# EAGLE design rat (EAGLE 9.6.2)
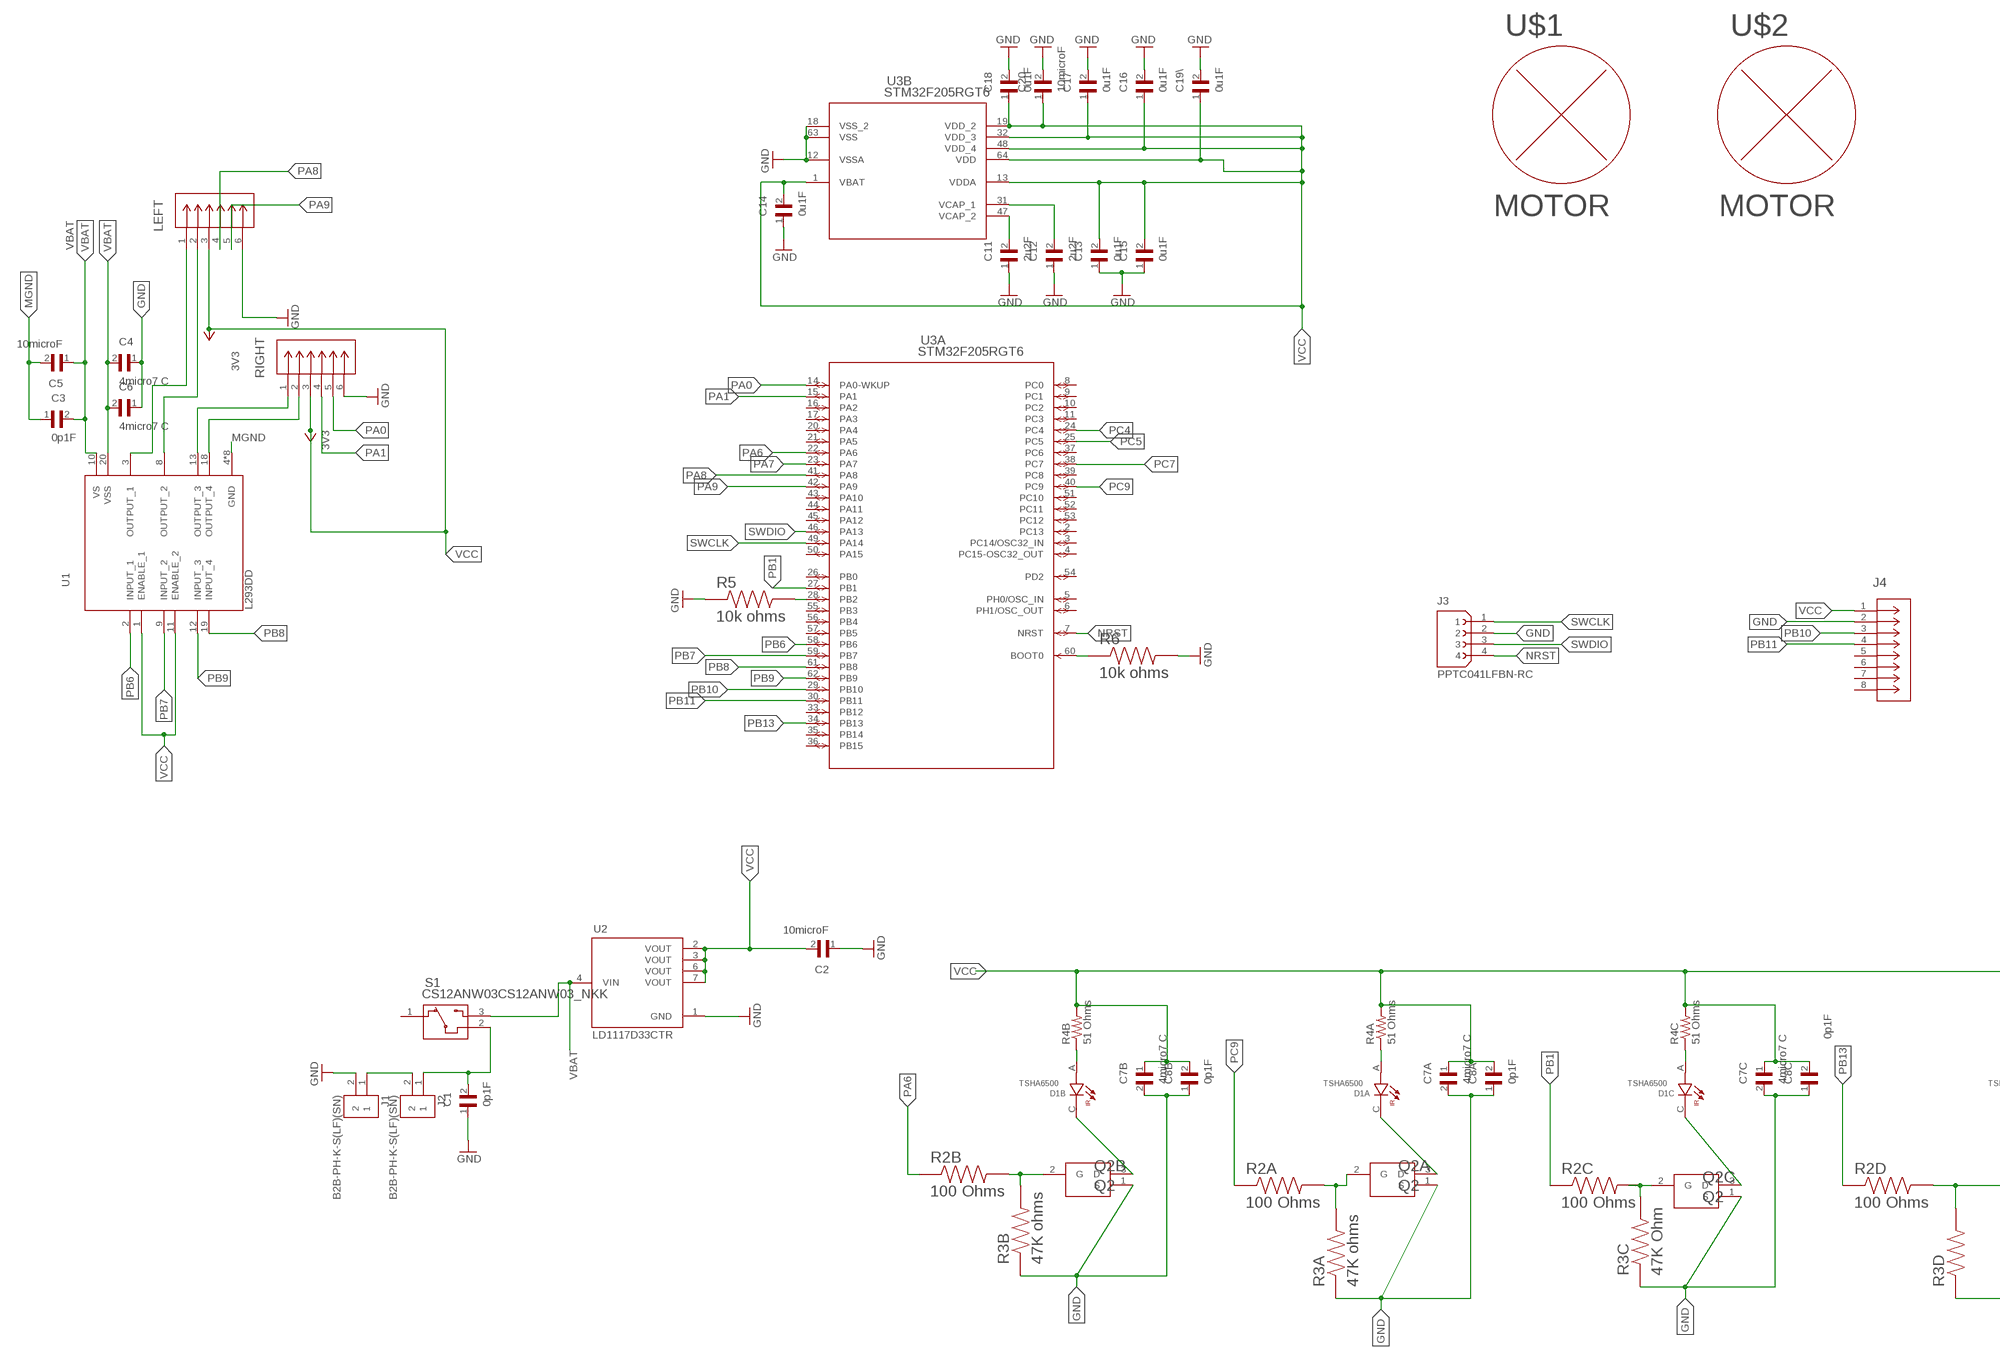
[diagram p0: schematic, sheet 1, part 1 of 2]
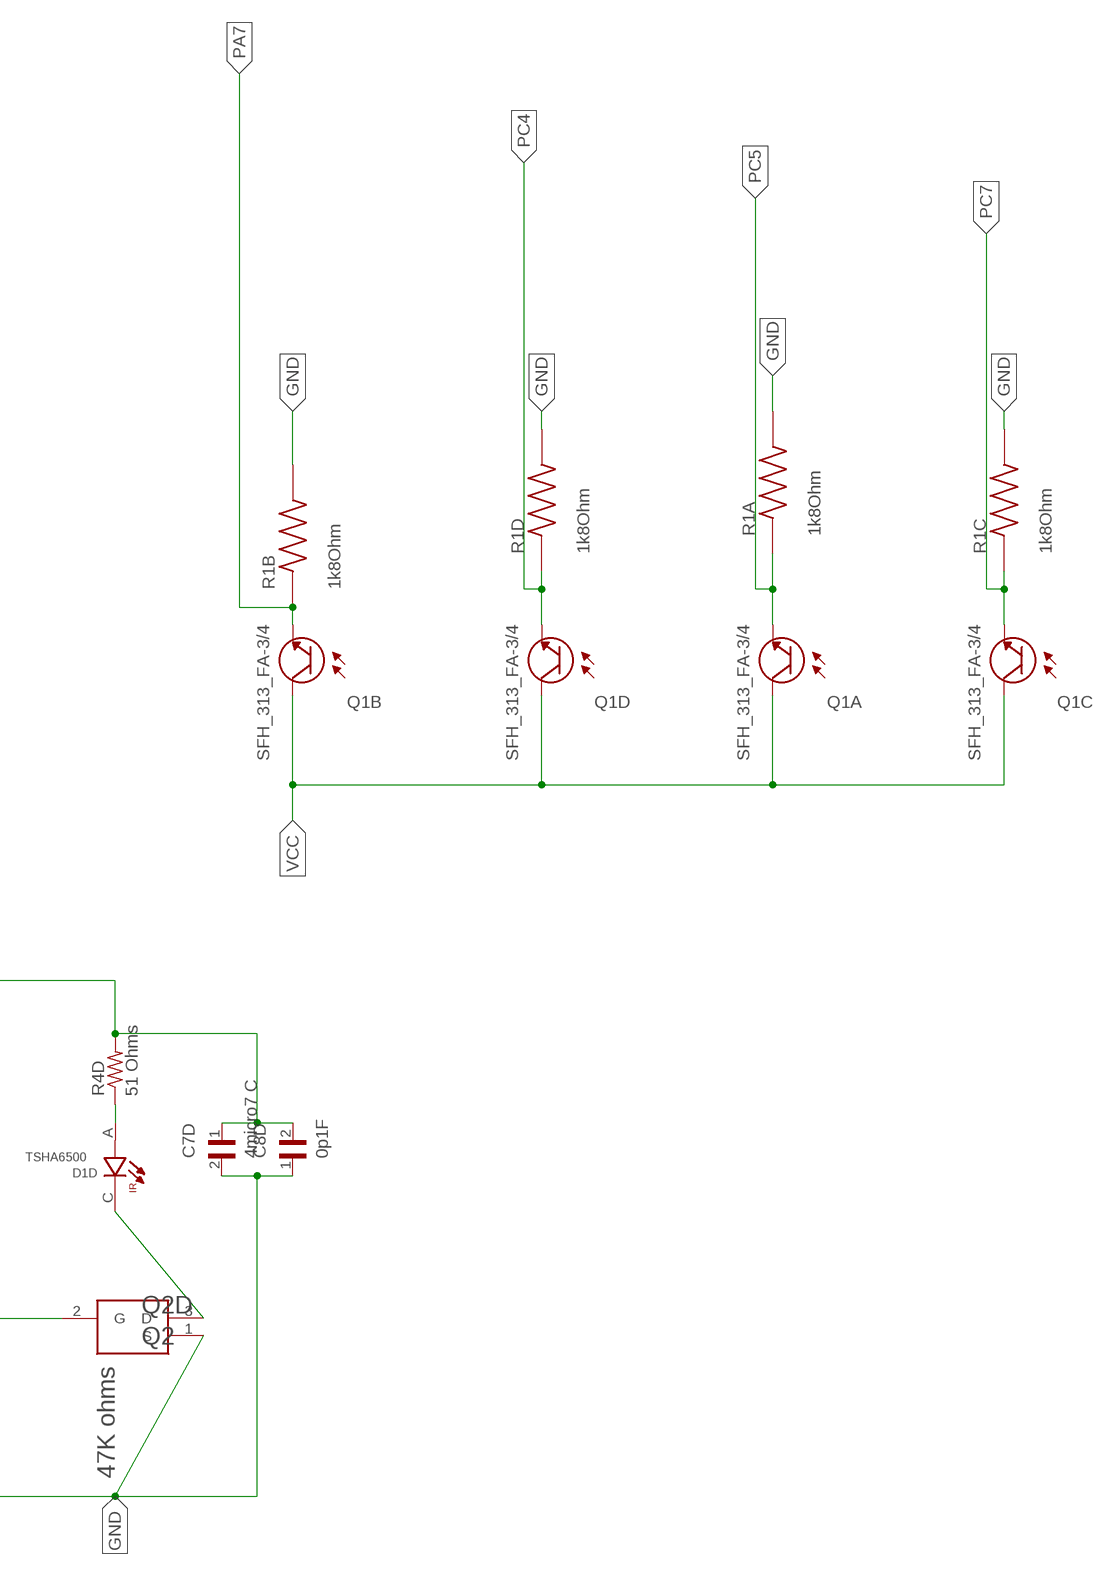
[diagram p1: schematic, sheet 1, part 2 of 2]

## Parts
C1  0p1F  12065C104JAT4A  [CAPC3216X94N]
C2  10microF  C2012X7S1C106M125AC  [CAPC2012X145N]
C3  0p1F  12065C104JAT4A  [CAPC3216X94N]
C4  4micro7 C  CL21A475KAQNNNE  [CAPC2012X140N]
C5  10microF  C2012X7S1C106M125AC  [CAPC2012X145N]
C6  4micro7 C  CL21A475KAQNNNE  [CAPC2012X140N]
C7A  4micro7 C  CL21A475KAQNNNE  [CAPC2012X140N]
C7B  4micro7 C  CL21A475KAQNNNE  [CAPC2012X140N]
C7C  4micro7 C  CL21A475KAQNNNE  [CAPC2012X140N]
C7D  4micro7 C  CL21A475KAQNNNE  [CAPC2012X140N]
C8A  0p1F  12065C104JAT4A  [CAPC3216X94N]
C8B  0p1F  12065C104JAT4A  [CAPC3216X94N]
C8C  0p1F  12065C104JAT4A  [CAPC3216X94N]
C8D  0p1F  12065C104JAT4A  [CAPC3216X94N]
C11  2u2F  CL31A225KB9LNNC  [CAPC3216X140N]
C12  2u2F  CL31A225KB9LNNC  [CAPC3216X140N]
C13  0u1F  12065C104JAT4A  [CAPC3216X94N]
C14  0u1F  12065C104JAT4A  [CAPC3216X94N]
C15  0u1F  12065C104JAT4A  [CAPC3216X94N]
C16  0u1F  12065C104JAT4A  [CAPC3216X94N]
C17  0u1F  12065C104JAT4A  [CAPC3216X94N]
C18  0u1F  12065C104JAT4A  [CAPC3216X94N]
C19\  0u1F  12065C104JAT4A  [CAPC3216X94N]
C20  10microF  C2012X7S1C106M125AC  [CAPC2012X145N]
D1A  TSHA6500  [LEDRD254W55D595H900]
D1B  TSHA6500  [LEDRD254W55D595H900]
D1C  TSHA6500  [LEDRD254W55D595H900]
D1D  TSHA6500  [LEDRD254W55D595H900]
J1  B2B-PH-K-S(LF)(SN)  [JST_B2B-PH-K-S(LF)(SN)]
J2  B2B-PH-K-S(LF)(SN)  [JST_B2B-PH-K-S(LF)(SN)]
J3  PPTC041LFBN-RC  [SULLINS_PPTC041LFBN-RC]
J4  PPTC081LFBN-RCCONN_PPTC081LFBN-RC_SUL  [CONN_PPTC081LFBN-RC_SUL]
LEFT  PPTC061LFBN-RCCONN6_061LFBN-RC_SUL  [CONN6_061LFBN-RC_SUL]
Q1A  SFH_313_FA-3/4  [XDCR_SFH_313_FA-3/4]
Q1B  SFH_313_FA-3/4  [XDCR_SFH_313_FA-3/4]
Q1C  SFH_313_FA-3/4  [XDCR_SFH_313_FA-3/4]
Q1D  SFH_313_FA-3/4  [XDCR_SFH_313_FA-3/4]
Q2A  Q2  2N7000_D26Z  [PF5102]
Q2B  Q2  2N7000_D26Z  [PF5102]
Q2C  Q2  2N7000_D26Z  [PF5102]
Q2D  Q2  2N7000_D26Z  [PF5102]
R1A  1k8Ohm  ERJH3EF1801V  [RES_ERJH3EF1801V]
R1B  1k8Ohm  ERJH3EF1801V  [RES_ERJH3EF1801V]
R1C  1k8Ohm  ERJH3EF1801V  [RES_ERJH3EF1801V]
R1D  1k8Ohm  ERJH3EF1801V  [RES_ERJH3EF1801V]
R2A  100 Ohms  RG2012P-101-B-T5  [RESC2012X50N]
R2B  100 Ohms  RG2012P-101-B-T5  [RESC2012X50N]
R2C  100 Ohms  RG2012P-101-B-T5  [RESC2012X50N]
R2D  100 Ohms  RG2012P-101-B-T5  [RESC2012X50N]
R3A  47K ohms  CRGCQ0402J47K  [RESC1005X40N]
R3B  47K ohms  CRGCQ0402J47K  [RESC1005X40N]
R3C  47K Ohm  CRGCQ0402J47K  [RESC1005X40N]
R3D  47K ohms  CRGCQ0402J47K  [RESC1005X40N]
R4A  51 Ohms  1623246-1  [RESC2012X65N]
R4B  51 Ohms  1623246-1  [RESC2012X65N]
R4C  51 Ohms  1623246-1  [RESC2012X65N]
R4D  51 Ohms  1623246-1  [RESC2012X65N]
R5  10k ohms  RN73C2A10KBTD  [RESC2012X65N]
R6  10k ohms  RN73C2A10KBTD  [RESC2012X65N]
RIGHT  PPTC061LFBN-RCCONN6_061LFBN-RC_SUL  [CONN6_061LFBN-RC_SUL]
S1  CS12ANW03CS12ANW03_NKK  [CS12ANW03_NKK]
U1  L293DD  [SOIC127P1032X265-20N]
U2  LD1117D33CTR  [SOIC127P600X175-8N]
U3  STM32F205RGT6  [LQFP64-10X10MM]
U$1  MOTOR  [MOTOR]
U$2  MOTOR  [MOTOR]

## Nets
GND: C1.1 C2.1 C4.1 C6.1 C7A.2 C7B.2 C7C.2 C7D.2 C8A.1 C8B.1 C8C.1 C8D.1 C11.1 C12.1 C13.1 C14.1 C15.1 C16.2 C17.2 C18.2 C19\.2 C20.2 J1.2 J3.2 J4.2 LEFT.6 Q2A.1(S) Q2B.1(S) Q2C.1(S) Q2D.1(S) R1A.2 R1B.2 R1C.2 R1D.2 R3A.1 R3B.1 R3C.1 R3D.1 R5.1 R6.2 RIGHT.6 U2.1(GND) U3.12(B:VSSA) U3.18(B:VSS_2) U3.63(B:VSS)
MGND: C3.1 C5.2 U1.4(GND) U1.5(GND) U1.6(GND) U1.7(GND) U1.14(GND) U1.15(GND) U1.16(GND) U1.17(GND)
N$1: J1.1 J2.2
N$2: C1.2 J2.1 S1.2
N$3: LEFT.1 U1.3(OUTPUT_1)
N$4: LEFT.2 U1.8(OUTPUT_2)
N$5: RIGHT.1 U1.13(OUTPUT_3)
N$6: RIGHT.2 U1.18(OUTPUT_4)
N$7: D1A.C Q2A.3(D)
N$8: Q2A.2(G) R2A.2 R3A.2
N$9: D1C.C Q2C.3(D)
N$10: Q2C.2(G) R2C.2 R3C.2
N$11: D1A.A R4A.1
N$12: D1C.A R4C.1
N$13: D1B.C Q2B.3(D)
N$14: Q2B.2(G) R2B.2 R3B.2
N$15: D1B.A R4B.1
N$16: D1D.C Q2D.3(D)
N$17: Q2D.2(G) R2D.2 R3D.2
N$18: D1D.A R4D.1
N$26: C11.2 U3.47(B:VCAP_2)
N$27: R6.1 U3.60(A:BOOT0)
N$28: R5.2 U3.28(A:PB2)
N$29: C12.2 U3.31(B:VCAP_1)
NRST: J3.4 U3.7(A:NRST)
PA0: RIGHT.5 U3.14(A:PA0-WKUP)
PA1: RIGHT.4 U3.15(A:PA1)
PA6: R2B.1 U3.22(A:PA6)
PA7: Q1B.1(E) R1B.1 U3.23(A:PA7)
PA8: LEFT.4 U3.41(A:PA8)
PA9: LEFT.5 U3.42(A:PA9)
PB1: R2C.1 U3.27(A:PB1)
PB6: U1.2(INPUT_1) U3.58(A:PB6)
PB7: U1.9(INPUT_2) U3.59(A:PB7)
PB8: U1.19(INPUT_4) U3.61(A:PB8)
PB9: U1.12(INPUT_3) U3.62(A:PB9)
PB10: J4.3 U3.29(A:PB10)
PB11: J4.4 U3.30(A:PB11)
PB13: R2D.1 U3.34(A:PB13)
PC4: Q1D.1(E) R1D.1 U3.24(A:PC4)
PC5: Q1A.1(E) R1A.1 U3.25(A:PC5)
PC7: Q1C.1(E) R1C.1 U3.38(A:PC7)
PC9: R2A.1 U3.40(A:PC9)
SWCLK: J3.1 U3.49(A:PA14)
SWDIO: J3.3 U3.46(A:PA13)
VBAT: C3.2 C4.2 C5.1 C6.2 S1.3 U1.10(VS) U1.20(VSS) U2.4(VIN)
VCC: C2.2 C7A.1 C7B.1 C7C.1 C7D.1 C8A.2 C8B.2 C8C.2 C8D.2 C13.2 C14.2 C15.2 C16.1 C17.1 C18.1 C19\.1 C20.1 J4.1 LEFT.3 Q1A.2(C) Q1B.2(C) Q1C.2(C) Q1D.2(C) R4A.2 R4B.2 R4C.2 R4D.2 RIGHT.3 U1.1(ENABLE_1) U1.11(ENABLE_2) U2.2(VOUT) U2.3(VOUT) U2.6(VOUT) U2.7(VOUT) U3.1(B:VBAT) U3.13(B:VDDA) U3.19(B:VDD_2) U3.32(B:VDD_3) U3.48(B:VDD_4) U3.64(B:VDD) ; supply symbol labelled 3V3
Unconnected: J4.5 J4.6 J4.7 J4.8 S1.1 U3.2(A:PC13) U3.3(A:PC14/OSC32_IN) U3.4(A:PC15-OSC32_OUT) U3.5(A:PH0/OSC_IN) U3.6(A:PH1/OSC_OUT) U3.8(A:PC0) U3.9(A:PC1) U3.10(A:PC2) U3.11(A:PC3) U3.16(A:PA2) U3.17(A:PA3) U3.20(A:PA4) U3.21(A:PA5) U3.26(A:PB0) U3.33(A:PB12) U3.35(A:PB14) U3.36(A:PB15) U3.37(A:PC6) U3.39(A:PC8) U3.43(A:PA10) U3.44(A:PA11) U3.45(A:PA12) U3.50(A:PA15) U3.51(A:PC10) U3.52(A:PC11) U3.53(A:PC12) U3.54(A:PD2) U3.55(A:PB3) U3.56(A:PB4) U3.57(A:PB5)

## Library data of the parts
C1 C3 C8A C8B C8C C8D C13-C18 C19\ = 12065C104JAT4A:12065C104JAT4A: CAP CER 0.1UF 50V X7R 1206; DESCRIPTION: 0.1 µF ±5% 50V Ceramic Capacitor X7R 1206 (3216 Metric); DIGI-KEY_PART_NUMBER: 478-12514-1-ND; MF: AVX; MP: 12065C104JAT4A; PACKAGE: 3216 AVX; PURCHASE-URL: https://pricing.snapeda.com/search/part/12065C104JAT4A/?ref=eda
C2 C5 C20 = C2012X7S1C106M125AC:C2012X7S1C106M125AC; DESCRIPTION: 10µF ±20% 16V Ceramic Capacitor X7S 0805 (2012 Metric); DIGI-KEY_PART_NUMBER: 445-175229-1-ND; MF: TDK; MP: C2012X7S1C106M125AC; PACKAGE: 2012 TDK; PURCHASE-URL: https://pricing.snapeda.com/search/part/C2012X7S1C106M125AC/?ref=eda
C4 C6 C7A C7B C7C C7D = CL21A475KAQNNNE:CL21A475KAQNNNE: CL21 Series 4.7 uF 25 V ±10 % Tolerance X5R SMT Multilayer Ceramic Capacitor; DESCRIPTION: 4.7 µF ±10% 25V Ceramic Capacitor X5R 0805 (2012 Metric); DIGI-KEY_PART_NUMBER: 1276-1244-1-ND; MF: Samsung Electro-Mechanics; MP: CL21A475KAQNNNE; PACKAGE: 0805 Samsung; PURCHASE-URL: https://pricing.snapeda.com/search/part/CL21A475KAQNNNE/?ref=eda
C11 C12 = CL31A225KB9LNNC:CL31A225KB9LNNC: Cap Ceramic 2.2uF 50V X5R 10% SMD 1206 85C T/R; DESCRIPTION: 2.2 µF ±10% 50V Ceramic Capacitor X5R 1206 (3216 Metric); DIGI-KEY_PART_NUMBER: 1276-2723-1-ND; MF: Samsung Electro-Mechanics; MP: CL31A225KB9LNNC; PACKAGE: 1206 Samsung; PURCHASE-URL: https://pricing.snapeda.com/search/part/CL31A225KB9LNNC/?ref=eda
D1A D1B D1C D1D = TSHA6500:TSHA6500: IR-EMITTER HIGH SPEED 870NM 5MM RoHSconf Check prices <https://pricing.snapeda.com/parts/TSHA6500/Vishay/view-part?ref=eda>; AVAILABILITY: Warning; DESCRIPTION: EMITTER IR 875NM 100MA RADIAL; MF: Vishay; MP: TSHA6500; PACKAGE: Radial Vishay; PRICE: None; PURCHASE-URL: https://pricing.snapeda.com/search/part/TSHA6500/?ref=eda
J1 J2 = B2B-PH-K-S_LF__SN_:B2B-PH-K-S(LF)(SN): PH Series 2 Position 2 mm Pitch Through Hole Top Entry Shrouded Header; DESCRIPTION: Connector Header Through Hole 2 position 0.079 (2.00mm); DIGI-KEY_PART_NUMBER: 455-1704-ND; MF: JST Sales; MP: B2B-PH-K-S(LF)(SN); PACKAGE: None
J3 = PPTC041LFBN-RC:PPTC041LFBN-RC: 4 Position Header Connector Through Hole; DESCRIPTION: 4 Position Header Connector 0.100 (2.54mm) Through Hole Tin; DIGI-KEY_PART_NUMBER: S7002-ND; MF: Sullins Connector; MP: PPTC041LFBN-RC; PACKAGE: None; PURCHASE-URL: https://pricing.snapeda.com/search/part/PPTC041LFBN-RC/?ref=eda
J4 = 2022-01-23_01-52-53_Library:PPTC081LFBN-RC; COPYRIGHT: Copyright (C) 2022 Ultra Librarian. All rights reserved.; DIGI-KEY_PART_NUMBER_1: S7006-ND; DIGI-KEY_PART_NUMBER_2: S7006-NDL; MANUFACTURER_PART_NUMBER: PPTC081LFBN-RC; MFR_NAME: Sullins
LEFT RIGHT = 2022-01-09_23-02-47_Library:PPTC061LFBN-RC; COPYRIGHT: Copyright (C) 2022 Ultra Librarian. All rights reserved.; DIGI-KEY_PART_NUMBER_1: S7004-ND; MANUFACTURER_PART_NUMBER: PPTC061LFBN-RC; MFR_NAME: Sullins
Q1A Q1B Q1C Q1D = SFH_313_FA-3_4:SFH_313_FA-3/4: Phototransistor IR Chip Silicon 870nm 2-Pin T-1 3/4; AVAILABILITY: Unavailable; DESCRIPTION: Phototransistors 870nm Top View Radial - 2 Leads; MF: OSRAM Opto; MP: SFH 313 FA-3/4; PACKAGE: Radial-2 Osram Opto; PRICE: None
Q2A Q2B Q2C Q2D = SamacSys_Parts:2N7000_D26Z: MOSFET N-Ch 60V 200mA Enhancement TO-92 Fairchild 2N7000_D26Z N-channel MOSFET Transistor, 200 mA, 60 V, 3-Pin TO-92 Source: Datasheet; ARROW_PART_NUMBER: 2N7000_D26Z; ARROW_PRICE-STOCK: https://www.arrow.com/en/products/2n7000-d26z/on-semiconductor?region=nac; DESCRIPTION: MOSFET N-Ch 60V 200mA Enhancement TO-92 Fairchild 2N7000_D26Z N-channel MOSFET Transistor, 200 mA, 60 V, 3-Pin TO-92; HEIGHT: 5.33mm; MANUFACTURER_NAME: ON Semiconductor; MANUFACTURER_PART_NUMBER: 2N7000_D26Z; MOUSER_PART_NUMBER: 512-2N7000D26Z; MOUSER_PRICE-STOCK: http://www.mouser.com/Search/ProductDetail.aspx?qs=VVLQfEDCVmOkjPtXWYsceQ%3d%3d
R1A R1B R1C R1D = ERJH3EF1801V:ERJH3EF1801V; DESCRIPTION: High Temperature Thick Film Chip Resistor (Automotive Grade), ERJH3E Series, 0.018K Ohm +/-1% , 0.125W , 0603 size , chip resistor (1.6 x 0.8 x 0.45mm); DIGI-KEY_PART_NUMBER: 10-ERJ-H3EF1801VCT-ND; MF: Panasonic; MP: ERJH3EF1801V; PACKAGE: 1608-2 Panasonic; PURCHASE-URL: https://pricing.snapeda.com/search/part/ERJH3EF1801V/?ref=eda
R2A R2B R2C R2D = RG2012P-101-B-T5:RG2012P-101-B-T5: Res Thin Film 0805 100 Ohm 0.1% 0.125W(1/8W) ?25ppm/C Molded SMD Automotive T/R; DESCRIPTION: 100 Ohms ±0.1% 0.125W, 1/8W Chip Resistor 0805 (2012 Metric) Anti-Sulfur, Automotive AEC-Q200 Thin Film; DIGI-KEY_PART_NUMBER: RG20P100BCT-ND; MF: Susumu; MP: RG2012P-101-B-T5; PACKAGE: 2012 TE Connectivity; PURCHASE-URL: https://pricing.snapeda.com/search/part/RG2012P-101-B-T5/?ref=eda
R3A R3B R3C R3D = CRGCQ0402J47K:CRGCQ0402J47K: Fixed Resistor CRGCQ 0402 47K 5% Check availability <https://pricing.snapeda.com/parts/CRGCQ0402J47K/TE%20Connectivity/view-part?ref=eda>; AVAILABILITY: In Stock; COMMENT: 2-2176338-9; DESCRIPTION: Fixed Resistor CRGCQ 0402 47K 5%; MF: TE Connectivity; MP: CRGCQ0402J47K; PACKAGE: 1005 Yageo; PRICE: None; PURCHASE-URL: https://pricing.snapeda.com/search/part/CRGCQ0402J47K/?ref=eda
R4A R4B R4C R4D = 1623246-1:1623246-1: CRG0805 1% 51R; COMMENT: 1623246-1; DESCRIPTION: 51 Ohms ±1% 0.125W, 1/8W Chip Resistor 0805 (2012 Metric) - Thick Film; DIGI-KEY_PART_NUMBER: A126374CT-ND; EU_ROHS_COMPLIANCE: Compliant with Exemptions; MF: TE Connectivity; MP: 1623246-1; PACKAGE: 0805; POWER_RATING: .125 W; RESISTANCE: 51; TOLERANCE: 1%; VOLTAGE_RATING: 150 V
R5 R6 = RN73C2A10KBTD:RN73C2A10KBTD: RN 0805 10K 0.1% 10PPM 5KRL Check availability <https://pricing.snapeda.com/parts/RN73C2A10KBTD/TE%20Connectivity/view-part?ref=eda>; AVAILABILITY: In Stock; COMMENT: 1676153-3; DESCRIPTION: RN 0805 10K 0.1% 10PPM 5KRL; EU_ROHS_COMPLIANCE: Compliant; MF: TE Connectivity; MP: RN73C2A10KBTD; PACKAGE: 0805; POWER_RATING: .1 W; PRICE: None; PURCHASE-URL: https://pricing.snapeda.com/search/part/RN73C2A10KBTD/?ref=eda; RESISTANCE: 10K; TOLERANCE: .1%; VOLTAGE_RATING: 100 V
S1 = 2022-01-23_02-20-39_Library:CS12ANW03; COPYRIGHT: Copyright (C) 2022 Ultra Librarian. All rights reserved.; DIGI-KEY_PART_NUMBER_1: 360-2131-ND; MANUFACTURER_PART_NUMBER: CS12ANW03; MFR_NAME: NKK Switches
U1 = L293DD:L293DD: L293DD Series Push - Pull Quad Channel Driver with Diodes - SOIC-20; DESCRIPTION: Bipolar Motor Driver Parallel 20-SOIC; DIGI-KEY_PART_NUMBER: 497-2937-2-ND; MF: STMicroelectronics; MP: L293DD; PACKAGE: SOIC-20 STMicroelectronics; PURCHASE-URL: https://pricing.snapeda.com/search/part/L293DD/?ref=eda
U2 = LD1117D33CTR:LD1117D33CTR: LD1117 Series 1300 mA Low Drop Fixed Positive Voltage Regulator - SOIC-8; DESCRIPTION: Linear Voltage Regulator IC Positive Fixed 1 Output 800mA 8-SOIC; DIGI-KEY_PART_NUMBER: 497-1230-1-ND; MF: STMicroelectronics; MP: LD1117D33CTR; PACKAGE: SOIC-8 STMicroelectronics; PURCHASE-URL: https://pricing.snapeda.com/search/part/LD1117D33CTR/?ref=eda
U3 = stm32f205rgt6:STM32F205RGT6; COPYRIGHT: Copyright (C) 2021 Ultra Librarian. All rights reserved.; MANUFACTURER_PART_NUMBER: STM32F205RGT6; MFR_NAME: STMicroelectronics
U$1 U$2 = micromouseMotors:MOTOR

## Board
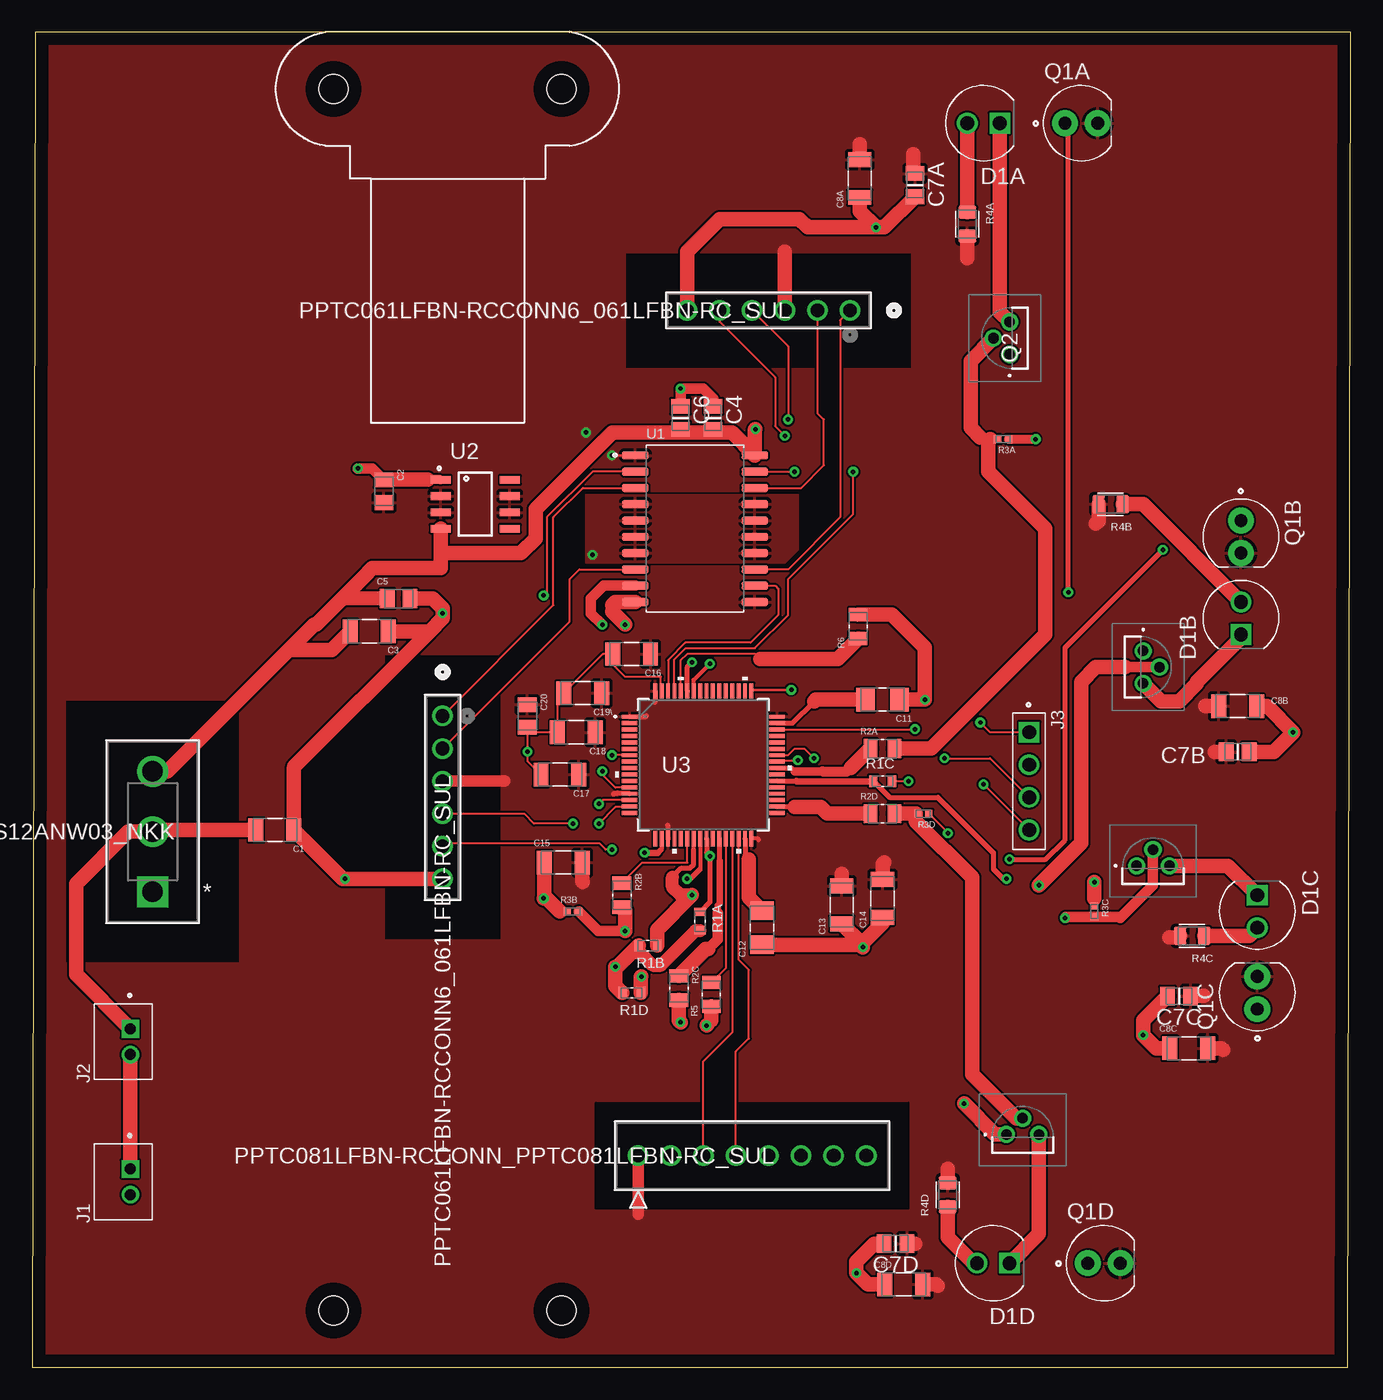
[diagram p2: board, top side]
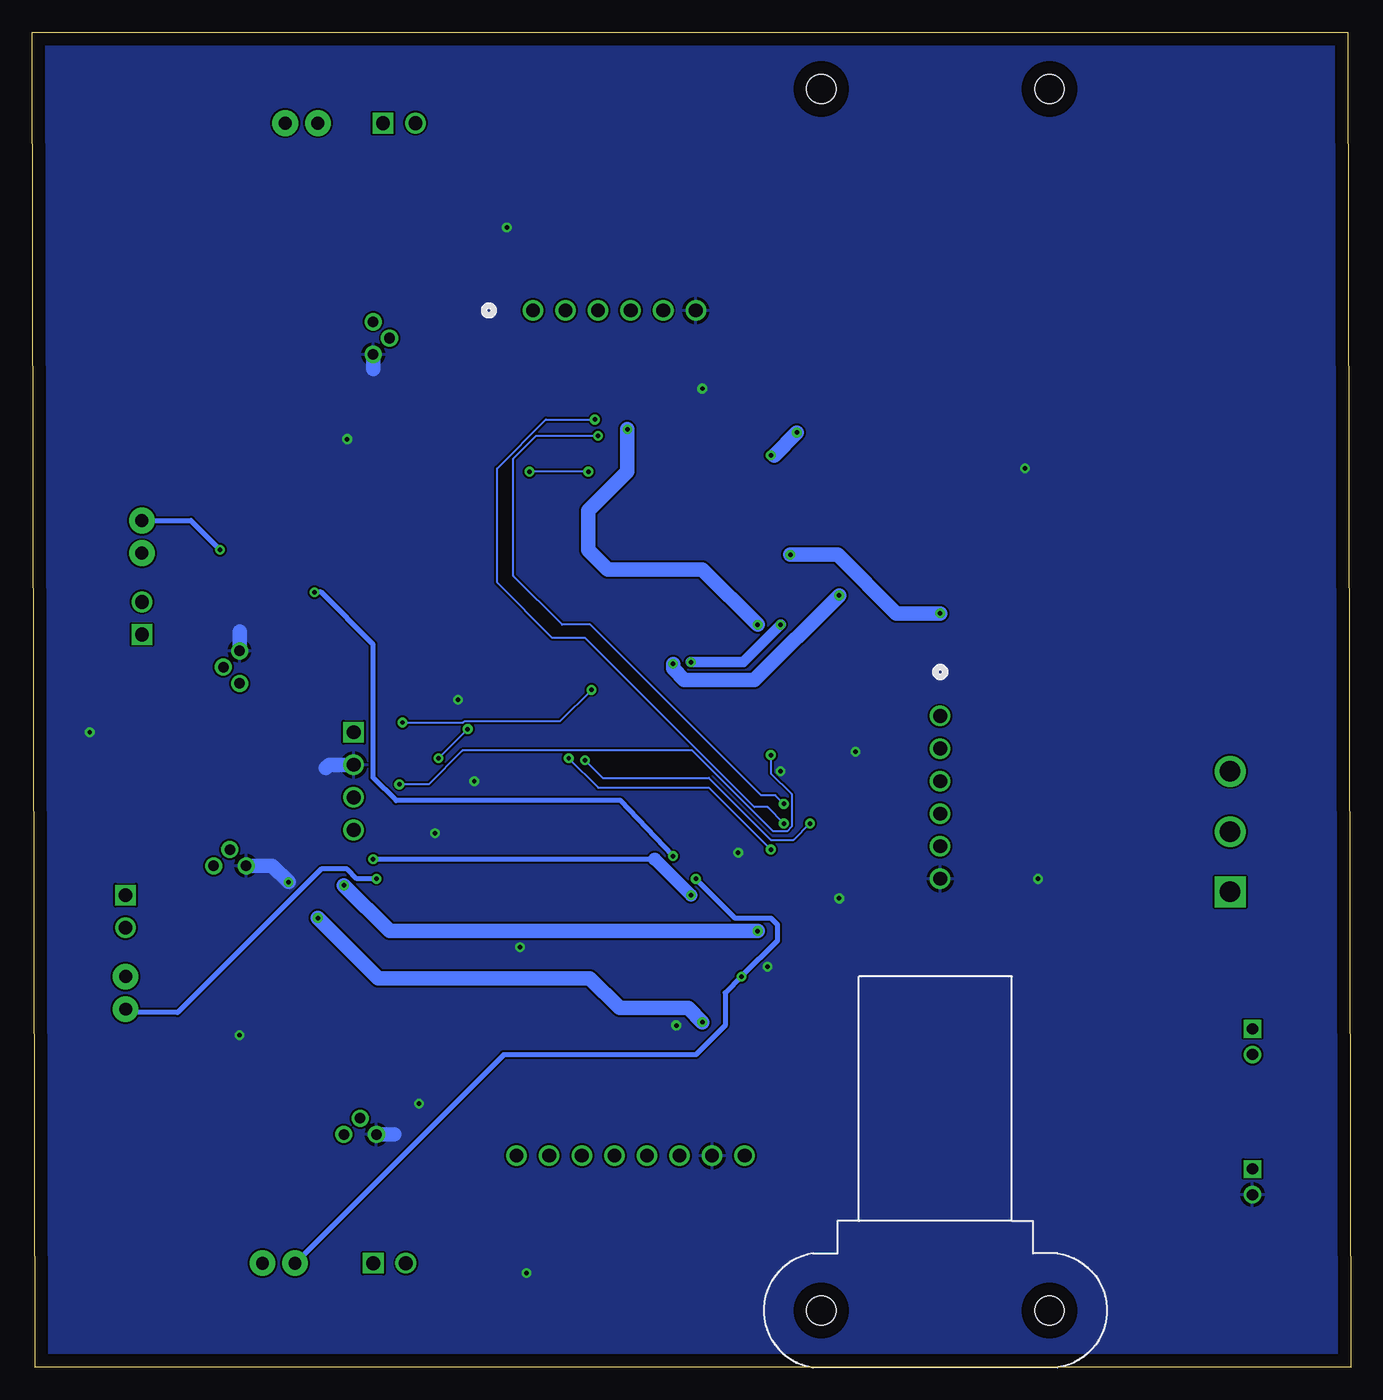
[diagram p3: board, bottom side, seen from below]

Size 102.79 x 104.13 mm. Coordinates in mm from the lower left corner, seen from the top.
Outline: 0,0 102.54,0 102.79,104.13 0.25,104.13 0,0
Copper layers (1*16): Top 0.035mm / dielectric 1.5mm / Bottom 0.035mm
Design rules "default": minimum track width 6mil, minimum drill 0.35mm, track to track 6mil, track to pad 6mil, pad to pad 6mil, via to via 6mil, smd to smd 6mil, copper to edge 40mil, drill to drill 6mil, minimum pad ring 10mil, minimum via ring 8mil, stop-mask expansion 4mil, vias tented up to drill 0mil, thermal gap 10mil

### Footprints (pad centres in the part's own frame; a part is rotated, then mirrored left to right if it is on the bottom)
CAPC3216X94N = smd 1.16 x 1.82: 1 -1.475,0; 2 1.475,0
CAPC2012X145N = smd 1.15 x 1.47: 1 -0.88,0; 2 0.88,0
CAPC2012X140N = smd 1.15 x 1.45: 1 -0.9,0; 2 0.9,0
CAPC3216X140N = smd 1.44 x 1.82: 1 -1.336,0; 2 1.336,0
LEDRD254W55D595H900 = drill 1.07 pad 1.61: A 1.27,0 | drill 1.07 pad 1.61 square: C -1.27,0
JST_B2B-PH-K-S(LF)(SN) = drill 0.86 square: 1 1,-0.55 | drill 0.86: 2 -1,-0.55
SULLINS_PPTC041LFBN-RC = drill 1.07 square: 1 -3.81,0 | drill 1.07: 2 -1.27,0; 3 1.27,0; 4 3.81,0
CONN_PPTC081LFBN-RC_SUL = drill 1.067 pad 1.575: 1 0,0; 2 -2.54,0; 3 -5.08,0; 4 -7.62,0; 5 -10.16,0; 6 -12.7,0; 7 -15.24,0; 8 -17.78,0
CONN6_061LFBN-RC_SUL = drill 1.067 pad 1.321: 1 0,0; 2 2.54,0; 3 5.08,0; 4 7.62,0; 5 10.16,0; 6 12.7,0
XDCR_SFH_313_FA-3/4 = drill 1 pad 2: 1 -1.27,0; 2 1.27,0
PF5102 = drill 0.82 pad 1.333: 1 0,0; 2 -1.27,-1.27; 3 -2.54,0
RES_ERJH3EF1801V = smd 0.65 x 0.9: 1 -0.725,0; 2 0.725,0
RESC2012X50N = smd 1.04 x 1.47: 1 -0.94,0; 2 0.94,0
RESC1005X40N = smd 0.56 x 0.6: 1 -0.435,0; 2 0.435,0
RESC2012X65N = smd 1 x 1.42: 1 -0.935,0; 2 0.935,0
CS12ANW03_NKK = drill 1.6 pad 2.108 square: 1 0,0 | drill 1.6 pad 2.108: 2 0,-4.699; 3 0,-9.398
SOIC127P1032X265-20N = smd 2.05 x 0.6: 1 -4.655,5.715; 2 -4.655,4.445; 3 -4.655,3.175; 4 -4.655,1.905; 5 -4.655,0.635; 6 -4.655,-0.635; 7 -4.655,-1.905; 8 -4.655,-3.175; 9 -4.655,-4.445; 10 -4.655,-5.715; 11 4.655,-5.715; 12 4.655,-4.445; 13 4.655,-3.175; 14 4.655,-1.905; 15 4.655,-0.635; 16 4.655,0.635; 17 4.655,1.905; 18 4.655,3.175; 19 4.655,4.445; 20 4.655,5.715
SOIC127P600X175-8N = smd 1.55 x 0.6: 1 -2.7,1.905; 2 -2.7,0.635; 3 -2.7,-0.635; 4 -2.7,-1.905; 5 2.7,-1.905; 6 2.7,-0.635; 7 2.7,0.635; 8 2.7,1.905
LQFP64-10X10MM = smd 1.194 x 0.305: 1 -5.75,3.75; 2 -5.75,3.25; 3 -5.75,2.75; 4 -5.75,2.25; 5 -5.75,1.75; 6 -5.75,1.25; 7 -5.75,0.75; 8 -5.75,0.25; 9 -5.75,-0.25; 10 -5.75,-0.75; 11 -5.75,-1.25; 12 -5.75,-1.75; 13 -5.75,-2.25; 14 -5.75,-2.75; 15 -5.75,-3.25; 16 -5.75,-3.75; 33 5.75,-3.75; 34 5.75,-3.25; 35 5.75,-2.75; 36 5.75,-2.25; 37 5.75,-1.75; 38 5.75,-1.25; 39 5.75,-0.75; 40 5.75,-0.25; 41 5.75,0.25; 42 5.75,0.75; 43 5.75,1.25; 44 5.75,1.75; 45 5.75,2.25; 46 5.75,2.75; 47 5.75,3.25; 48 5.75,3.75 | smd 0.305 x 1.194: 17 -3.75,-5.75; 18 -3.25,-5.75; 19 -2.75,-5.75; 20 -2.25,-5.75; 21 -1.75,-5.75; 22 -1.25,-5.75; 23 -0.75,-5.75; 24 -0.25,-5.75; 25 0.25,-5.75; 26 0.75,-5.75; 27 1.25,-5.75; 28 1.75,-5.75; 29 2.25,-5.75; 30 2.75,-5.75; 31 3.25,-5.75; 32 3.75,-5.75; 49 3.75,5.75; 50 3.25,5.75; 51 2.75,5.75; 52 2.25,5.75; 53 1.75,5.75; 54 1.25,5.75; 55 0.75,5.75; 56 0.25,5.75; 57 -0.25,5.75; 58 -0.75,5.75; 59 -1.25,5.75; 60 -1.75,5.75; 61 -2.25,5.75; 62 -2.75,5.75; 63 -3.25,5.75; 64 -3.75,5.75
MOTOR = hole 2.286: -28.575,14.605; -28.575,-3.175

### Placement (x,y rotation side)
C1  18.92,41.91 180 top
C2  27.43,68.33 270 top
C3  26.29,57.4 180 top
C4  53.09,74.04 270 top
C5  28.57,59.94 0 top
C6  50.55,74.04 270 top
C7A  68.83,92.2 270 top
C7B  93.98,48.01 0 top
C7C  89.41,28.96 180 top
C7D  67.31,9.65 180 top
C8A  64.52,92.71 90 top
C8B  93.98,51.56 180 top
C8C  90.17,24.89 0 top
C8D  67.94,6.48 0 top
C11  66.29,52.07 180 top
C12  56.9,34.29 90 top
C13  63.12,36.07 90 top
C14  66.29,36.58 90 top
C15  41.4,39.37 0 top
C16  46.74,55.63 180 top
C17  41.15,46.23 180 top
C18  42.42,49.53 180 top
C19\  42.93,52.58 180 top
C20  38.61,50.8 270 top
D1A  74.17,97.03 180 top
D1B  94.23,58.42 90 top
D1C  95.5,35.56 270 top
D1D  74.93,8.13 180 top
J1  7.11,14.48 90 top
J2  7.11,25.4 90 top
J3  77.72,45.72 270 top
J4  47.24,16.51 180 top
LEFT  32,50.8 270 top
Q1A  81.79,97.03 0 top
Q1B  94.23,64.77 270 top
Q1C  95.5,29.21 90 top
Q1D  83.57,8.13 0 top
Q2A  76.2,78.99 270 top
Q2B  86.61,55.88 90 top
Q2C  86.11,39.12 180 top
Q2D  75.95,18.16 180 top
R1A  52.07,34.8 270 top
R1B  48.01,32.89 180 top
R1C  66.29,45.72 0 top
R1D  46.74,29.21 180 top
R2A  66.29,48.26 0 top
R2B  45.97,36.83 270 top
R2C  50.42,29.59 270 top
R2D  66.29,43.18 0 top
R3A  75.69,72.39 180 top
R3B  42.16,35.56 0 top
R3C  82.8,35.56 270 top
R3D  69.47,43.18 180 top
R4A  72.9,89.15 270 top
R4B  84.07,67.31 180 top
R4C  90.42,33.66 180 top
R4D  71.37,13.46 90 top
R5  52.96,29.08 90 top
R6  64.39,57.79 90 top
RIGHT  63.75,82.42 180 top
S1  9.4,37.08 180 top
U1  51.69,65.41 0 top
U2  34.54,67.31 0 top
U3  52.32,46.99 0 top
U$1  26.67,33.02 90 bottom
U$2  26.67,71.12 270 top

### Tracks (layer width: path | path; a pad name or v marks a point on that pad's centre or on a via)
GND  (via drill 0.35)
  Top 0.152: U3.12 46.55,45.21 45.47,45.21 44.45,46.23 v44.45,46.48 | R1B.2 47.12,32.89 | 39.93,36.62 v39.88,36.58 | C17.2 38.61,47.29 v38.61,48.01 C20.2 39,49.53 C18.2 40.94,52.07 C19\.2 44.5,55.63 C16.2 45.26,54.82 46.23,53.85 49.02,53.85 49.02,52.79 U3.63 | R1C.2 v68.33,45.72 | R3D.1 71.37,41.71 v71.37,41.66 v71.38,41.66
  Top 0.305: U3.18 49.07,40.44
  Top 0.381: 41.15,35.56 R3B.1 | 49.07,40.44 48.77,40.13
  Top 0.508: 48.77,40.13 v47.75,40.13
  Top 0.61: R3C.1 82.8,36.58
  Top 0.711: U2.1 30.86,69.22 | R3A.1 v78.23,72.39
  Top 0.813: C6.1 v50.55,76.33 52.32,76.33 53.09,75.56 C4.1 | v25.4,70.1 26.53,70.1 C2.1
  Top 1.016: 46.75,32.37 47.39,32.37 48.39,31.37 49.02,31.37 51.73,34.07 R1A.2
  Top 1.143: C7D.2 65.66,9.65 64.26,8.25 v64.26,7.37 65.15,6.48 C8D.1 | C8C.1 87.63,24.89 v86.61,25.91 86.61,27.06 C7C.2 | R5.1 52.96,27.05 v52.58,26.67 | C12.1 64.58,32.95 | 64.58,32.95 v64.77,32.77 | C13.1 64.58,33.13 64.58,32.95 | C14.1 66.29,34.67 64.58,32.95 | C15.1 39.93,36.62 | v39.88,36.58 40.13,36.58 41.15,35.56 | R1B.2 46.75,32.37 45.63,31.24 v45.47,31.24 45.47,29.76 R1D.2 | RIGHT.6 51.05,86.99 53.59,89.53 59.82,89.53 60.45,88.9 v65.79,88.9 | v65.79,88.9 64.52,90.17 C8A.1 | v65.79,88.9 66.43,88.9 C7A.2 | C11.1 v69.6,52.07 69.6,56.13 67.01,58.72 R6.2 | C1.1 20.45,41.96 | Q2D.1 75.06,18.16 v72.64,20.57 | C7B.2 96.77,48.01 v98.3,49.53 96.27,51.56 C8B.1 | 82.8,36.58 v82.8,37.85 | 30.86,69.22 C2.1 | C1.1 24.21,38.1 v24.38,38.1 LEFT.6 | C1.1 20.4,46.69
  Bottom 1.143: J3.2 79.63,46.99 79.88,46.74 | v82.8,37.85 84.07,39.12 Q2C.1 | Q2B.1 86.61,57.4 | Q2A.1 76.2,77.85 | Q2D.1 74.55,18.16
  pour Bottom (rank 2): -2.03,106.68 104.14,106.68 104.14,-1.02 104.9,-1.78 -6.6,-1.78 -7.11,-2.29 -7.11,101.6
MGND  (via drill 0.35)
  Top 1.143: C3.1 30.99,57.4 | 30.99,57.4 32,58.42 v32,58.8 32,59.18 31.24,59.94 C5.2 | 30.99,57.4 20.45,46.86
  Bottom 1.143: v43.69,63.37 40,63.37 35.43,58.8 v32,58.8
  pour Top: 43.18,68.07 59.69,68.07 59.69,63.75 58.67,62.74 58.42,62.74 43.18,62.74
N$1
  Top 1.143: J2.2 J1.1
N$2
  Top 1.143: J2.1 3.43,30.63 3.43,37.72 7.49,41.78 S1.2 9.53,41.91 C1.2
N$3
  Top 0.152: LEFT.1 40.64,59.44 40.64,66.29 42.93,68.58 U1.3
N$4
  Top 0.152: LEFT.2 41.91,58.17 41.91,61.47 42.67,62.23 U1.8
N$5
  Top 0.152: RIGHT.1 62.99,81.66 62.99,66.29 58.93,62.23 U1.13
N$6
  Top 0.152: U1.18 59.94,68.58 61.72,70.36 61.72,73.91 61.21,74.42 RIGHT.2
N$7
  Top 1.143: D1A.C 75.44,82.3 Q2A.3
N$8
  Top 0.61: 73.91,72.52 74.04,72.39 74.68,72.39 R3A.2
  Top 1.143: R2A.2 70.1,48.26 78.99,57.15 78.99,65.41 74.55,69.85 74.55,72.26 74.68,72.39 | Q2A.2 73.15,78.49 73.15,73.28 73.91,72.52
N$9
  Top 1.143: D1C.C 93.22,39.12 Q2C.3
N$10  (via drill 0.35)
  Top 0.813: Q2C.2 87.38,37.59 84.84,35.05 84.76,35.12 R3C.2 80.59,35.12 v80.52,35.05
  Top 1.143: v50.55,26.92 50.42,27.05 R2C.2
  Bottom 1.143: v50.55,26.92 51.66,28.04 56.99,28.04 59.31,30.35 75.82,30.35 v80.52,35.05
N$11
  Top 1.143: D1A.A R4A.1
N$12
  Top 1.143: D1C.A 94.87,33.66 R4C.1
N$13
  Top 1.143: D1B.C 94.23,56.9 90.8,53.47 90.8,53.34 89.41,51.94 88.01,51.94 Q2B.3
N$14  (via drill 0.35)
  Top 0.813: R3B.2 44.12,34.04 v46.23,34.04 | Q2B.2 85.22,54.61
  Top 1.143: v78.49,37.59 81.79,40.89 81.79,53.47 82.93,54.61 85.22,54.61 | R2B.2 46.23,35.64 v46.23,34.04
  Bottom 1.143: v46.23,34.04 74.93,34.04 v78.49,37.59
N$15
  Top 1.143: R4B.1 86.61,67.31 D1B.A
N$16
  Top 1.143: Q2D.3 78.49,10.41 D1D.C
N$17
  Top 0.152: R3D.2 68.9,43.18
  Top 1.143: R2D.2 68.9,43.18 68.9,42.58 73.28,38.2 73.28,22.86 76.71,19.43 Q2D.2
N$18
  Top 1.143: R4D.1 71.37,10.16 73.41,8.13 D1D.A
N$26
  Top 0.381: U3.47 59.26,50.24 60.96,51.94
  Top 1.143: 60.96,51.94 61.09,52.07 C11.2
N$27
  Top 0.152: U3.60 50.57,55.15 51.05,55.63 56.39,55.63 56.77,55.25
  Top 1.143: 56.77,55.25 62.78,55.25 R6.1
N$28
  Top 0.152: U3.28 54.07,31.13 R5.2
N$29
  Top 0.381: U3.31 55.57,39.93 55.88,39.62
  Top 1.143: C12.2 55.88,36.64 55.88,39.62
NRST  (via drill 0.35)
  Top 0.152: U3.7 v45.22,47.74 v45.21,47.75 | J3.4 v74.17,45.47
  Bottom 0.152: v74.17,45.47 71.88,45.47 69.24,48.11 51.33,48.11 45.04,41.81 43.95,41.81 43.59,42.17 43.59,44.7 45.21,46.32 v45.21,47.75
PA0  (via drill 0.35)
  Top 0.152: U3.14 44.49,44.24 v44.2,43.94 | RIGHT.5 53.59,81.53 57.91,77.22 57.91,73.41 v58.67,72.64
  Bottom 0.152: v44.2,43.94 44.86,44.61 45.97,44.61 59.28,57.91 61.47,57.91 65.28,61.72 65.28,70.87 63.5,72.64 v58.67,72.64
PA1  (via drill 0.35)
  Top 0.152: U3.15 46.52,43.69 45.47,43.69 v44.2,42.42 | RIGHT.4 58.93,79.63 v58.93,73.91
  Bottom 0.152: v44.2,42.42 45.47,43.69 46.48,43.69 59.69,56.9 62.23,56.9 66.55,61.21 66.55,70.1 62.74,73.91 v58.93,73.91
PA6
  Top 0.152: R2B.1 47.57,39.37 51.07,39.37 U3.22
PA7  (via drill 0.35)
  Top 0.305: 51.56,40.39 51.56,41.23 U3.23
  Top 0.406: v76.2,39.62 78.99,39.62 80.52,41.15 80.52,56.13 v88.14,63.75 | 51.56,40.39 51.56,39.22 51.28,38.94 50.62,38.94 49.91,38.23
  Top 1.016: 49.91,38.23 49.91,37.46 50.55,36.83 v51.43,36.83
  Top 1.143: R1B.1 48.73,34.13 v51.43,36.83
  Bottom 0.381: Q1B.1 90.42,66.04 v88.14,63.75
  Bottom 0.406: 54.26,39.62 v76.2,39.62
  Bottom 1.016: v51.43,36.83 54.23,39.62 54.26,39.62
PA8  (via drill 0.35)
  Top 0.152: U3.41 58.18,47.35 v59.69,47.35 | v42.16,42.42 39.12,42.42 38.35,43.18 LEFT.4
  Bottom 0.152: v59.69,47.35 58.32,45.97 50.04,45.97 45.21,41.15 43.43,41.15 v42.16,42.42
PA9  (via drill 0.35)
  Top 0.152: U3.42 58.09,47.75 58.93,47.75 59.44,48.26 60.2,48.26 v60.96,47.5 | v45.21,40.39 44.7,40.39 44.2,40.89 32.26,40.89 LEFT.5
  Bottom 0.152: v60.96,47.5 58.67,45.21 50.04,45.21 v45.21,40.39
PB1
  Top 0.381: U3.27 53.57,39.51 53.59,39.5
  Top 0.508: 53.44,35.43 53.44,36.03 53.59,36.18 53.59,39.5
  Top 0.813: 52.7,32.64 53.44,33.37 53.44,35.43
  Top 1.143: R2C.1 52.53,32.64 52.7,32.64
PB6  (via drill 0.35)
  Top 0.152: U1.2 43.69,69.85 40.13,66.29 40.13,60.45 v39.88,60.2
  Top 0.305: U3.58 51.57,53.61 v52.83,54.86
  Bottom 1.143: v52.83,54.86 52.83,54.48 51.94,53.59 46.48,53.59 v39.88,60.2
PB7  (via drill 0.35)
  Top 0.381: U3.59 51.07,54.63 v51.43,54.99
  Top 0.813: v44.45,57.91 43.56,58.8 43.56,59.94 44.58,60.96 U1.9
  Bottom 0.813: v44.45,57.91 47.37,54.99 v51.43,54.99
PB8  (via drill 0.35)
  Top 0.152: U1.19 v59.44,69.85 | U3.61 50.07,55.2 50.95,56.08 56.34,56.08 58.93,58.67 58.93,61.47 64.01,66.55 v64.01,69.85
  Bottom 0.152: v59.44,69.85 v64.01,69.85
PB9
  Top 0.152: U1.12 57.91,60.96 58.17,60.71 58.17,58.67 56.01,56.52 50.93,56.52 49.57,55.16 U3.62
PB10
  Top 0.152: J4.3 52.32,23.88 54.61,26.16 54.61,41.2 U3.29
PB11
  Top 0.152: J4.4 54.86,24.64 55.88,25.65 55.88,30.99 55.07,31.79 U3.30
PB13
  Top 0.381: U3.34 59.38,43.74 59.44,43.69
  Top 1.143: R2D.1 61.98,43.18 61.47,43.69 59.44,43.69
PC4  (via drill 0.35)
  Top 0.305: U3.24 52.07,38.87
  Top 0.406: v51.05,38.1 51.31,38.1 52.07,38.87
  Top 1.143: R1D.1 47.46,30.44 v47.5,30.48
  Bottom 0.406: v51.05,38.1 48.01,35.05 45.21,35.05 44.7,34.54 44.7,33.27 v47.5,30.48 48.77,29.21 48.77,26.67 51.05,24.38 66.04,24.38 Q1D.1
PC5  (via drill 0.35)
  Top 0.381: U3.25 52.57,40.14 v52.83,39.88
  Top 0.406: v80.77,60.45 80.77,96.77 Q1A.1 | R1A.1 52.83,36.28 v52.83,39.88
  Bottom 0.406: v52.83,39.88 56.9,44.2 74.42,44.2 76.2,45.97 76.2,56.39 80.26,60.45 v80.77,60.45
PC7  (via drill 0.35)
  Top 0.381: U3.38 59.54,45.74
  Top 0.406: v75.95,38.1 75.69,38.1 74.93,38.86 74.93,40.13 70.61,44.45 66.84,44.45 R1C.1 65.55,45.74 | 59.54,45.74 59.56,45.72
  Top 0.508: 59.56,45.72 59.59,45.7 65.5,45.7 65.55,45.74
  Bottom 0.406: Q1C.1 95.25,27.69 91.44,27.69 80.26,38.86 78.23,38.86 77.47,38.1 v75.95,38.1
PC9
  Top 0.381: U3.40 59.18,46.74 59.44,46.48
  Top 0.66: 59.44,46.48 61.59,46.48
  Top 0.762: 61.59,46.48 63.58,46.48 63.83,46.74
  Top 1.143: 63.83,46.74 R2A.1
SWCLK  (via drill 0.35)
  Top 0.152: J3.1 74.68,49.53 v73.91,50.29
  Top 0.203: U3.49 56.17,52.83 v59.18,52.83
  Bottom 0.152: v73.91,50.29 69.18,50.29 69.08,50.39 61.62,50.39 v59.18,52.83
SWDIO  (via drill 0.35)
  Top 0.152: U3.46 68.79,49.74 v68.83,49.78 | v71.12,47.5 74.68,47.5 J3.3
  Bottom 0.152: v68.83,49.78 v71.12,47.5
VBAT  (via drill 0.35)
  Top 0.152: 45.21,59.44 45.21,58.93
  Top 0.61: C6.2 50.55,72.9 | C4.2 53.21,73.01 53.21,72.9
  Top 1.143: S1.3 10.54,46.48 20,55.94 | 20,55.94 21.98,57.92 22.14,57.92 24.21,59.99 | 31.84,63.5 38.1,63.5 39.24,64.64 39.24,66.93 45.21,72.9 50.55,72.9 53.21,72.9 54.57,72.9 U1.20 56.34,73.11 v56.39,73.15 | C5.1 24.21,59.99 | U2.4 31.84,63.5 | 31.84,63.5 31.84,62.32 26.51,62.32 26.16,61.98 26.16,61.94 24.21,59.99 | U1.10 45.47,59.69 45.21,59.44 | 45.21,58.93 v46.23,57.91 | 20,55.94 23.35,55.94 C3.2
  Bottom 1.143: v46.23,57.91 50.55,62.23 57.91,62.23 59.44,63.75 59.44,66.8 56.39,69.85 v56.39,73.15
VCC  (via drill 0.35)
  Top 0.152: U1.1 v45.21,71.12
  Top 0.305: 56.55,41.24 U3.32
  Top 0.381: 56.64,41.15 56.55,41.24 | U3.19 49.57,42.25 49.53,42.29 | U3.64 48.57,51.88 | U3.1 47.82,50.74 47.88,50.8 | U3.13 45.38,44.74 45.34,44.7
  Top 0.889: LEFT.3 36.83,45.72 | J4.1 47.24,11.94
  Top 1.143: C7D.1 68.83,9.65 | C8D.2 70.48,6.48 70.61,6.35 | C8C.2 92.71,24.89 92.84,24.77 | C7C.1 91.31,28.96 | R4C.2 89.36,33.53 88.65,33.53 | R4D.2 71.37,15.49 | C7B.1 92.2,48.01 | C8B.2 91.44,51.56 | R4B.2 83.14,65.99 82.93,65.79 | C13.2 63.12,38.48 | C14.2 66.29,39.24 66.42,39.37 | C15.2 42.88,37.9 42.93,37.85 | R4A.2 72.9,86.49 | C8A.2 64.52,95.38 | C7A.1 68.71,93.23 68.71,94.61 | RIGHT.3 58.67,86.99
  Bottom 0.152: v45.21,71.12 44.96,71.12
  Bottom 1.143: 44.96,71.12 v43.18,72.9
  pour Top (rank 2): -1.78,106.68 105.66,106.68 105.66,-2.29 -1.78,-2.29